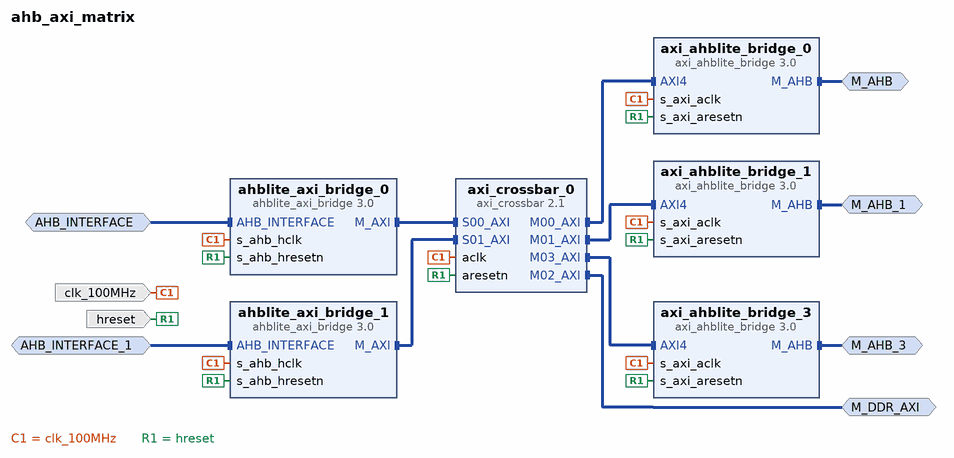
[diagram p0: block diagram of the top level]
# Vivado block design ahb_axi_matrix, xc7k325tffg900-2, Vivado 2019.1
create_bd_design ahb_axi_matrix

create_bd_intf_port -mode Slave -vlnv xilinx.com:interface:ahblite_rtl:2.0 AHB_INTERFACE
create_bd_intf_port -mode Slave -vlnv xilinx.com:interface:ahblite_rtl:2.0 AHB_INTERFACE_1
create_bd_intf_port -mode Master -vlnv xilinx.com:interface:ahblite_rtl:2.0 M_AHB
create_bd_intf_port -mode Master -vlnv xilinx.com:interface:ahblite_rtl:2.0 M_AHB_1
create_bd_intf_port -mode Master -vlnv xilinx.com:interface:ahblite_rtl:2.0 M_AHB_3
create_bd_intf_port -mode Master -vlnv xilinx.com:interface:aximm_rtl:1.0 M_DDR_AXI
set_property -dict [list \
  CONFIG.ADDR_WIDTH 32 \
  CONFIG.DATA_WIDTH 32 \
  CONFIG.HAS_BURST 0 \
  CONFIG.HAS_QOS 0 \
  CONFIG.HAS_REGION 0 \
  CONFIG.NUM_READ_OUTSTANDING 2 \
  CONFIG.NUM_WRITE_OUTSTANDING 2 \
  CONFIG.PROTOCOL AXI4 \
] [get_bd_intf_ports M_DDR_AXI]
create_bd_port -dir I -type clk clk_100MHz
set_property -dict {CONFIG.FREQ_HZ 100000000} [get_bd_ports clk_100MHz]
create_bd_port -dir I hreset

create_bd_cell -type ip -vlnv xilinx.com:ip:axi_crossbar:2.1 axi_crossbar_0
set_property -dict [list \
  CONFIG.ADDR_WIDTH 32 \
  CONFIG.M00_A00_ADDR_WIDTH 16 \
  CONFIG.M00_A00_BASE_ADDR 0x00000000FFFF0000 \
  CONFIG.M00_S00_READ_CONNECTIVITY 1 \
  CONFIG.M00_S00_WRITE_CONNECTIVITY 1 \
  CONFIG.M00_S01_READ_CONNECTIVITY 1 \
  CONFIG.M00_S01_WRITE_CONNECTIVITY 1 \
  CONFIG.M01_A00_ADDR_WIDTH 16 \
  CONFIG.M01_A00_BASE_ADDR 0x0000000010000000 \
  CONFIG.M01_S00_READ_CONNECTIVITY 1 \
  CONFIG.M01_S00_WRITE_CONNECTIVITY 1 \
  CONFIG.M01_S01_READ_CONNECTIVITY 1 \
  CONFIG.M01_S01_WRITE_CONNECTIVITY 1 \
  CONFIG.M02_A00_ADDR_WIDTH 22 \
  CONFIG.M02_A00_BASE_ADDR 0x0000000040000000 \
  CONFIG.M02_S00_READ_CONNECTIVITY 1 \
  CONFIG.M02_S00_WRITE_CONNECTIVITY 1 \
  CONFIG.M02_S01_READ_CONNECTIVITY 1 \
  CONFIG.M02_S01_WRITE_CONNECTIVITY 1 \
  CONFIG.M03_A00_ADDR_WIDTH 20 \
  CONFIG.M03_A00_BASE_ADDR 0x0000000080000000 \
  CONFIG.M03_S00_READ_CONNECTIVITY 1 \
  CONFIG.M03_S00_WRITE_CONNECTIVITY 1 \
  CONFIG.M03_S01_READ_CONNECTIVITY 1 \
  CONFIG.M03_S01_WRITE_CONNECTIVITY 1 \
  CONFIG.NUM_MI 4 \
  CONFIG.NUM_SI 2 \
] [get_bd_cells axi_crossbar_0]
create_bd_cell -type ip -vlnv xilinx.com:ip:ahblite_axi_bridge:3.0 ahblite_axi_bridge_0
create_bd_cell -type ip -vlnv xilinx.com:ip:ahblite_axi_bridge:3.0 ahblite_axi_bridge_1
create_bd_cell -type ip -vlnv xilinx.com:ip:axi_ahblite_bridge:3.0 axi_ahblite_bridge_0
create_bd_cell -type ip -vlnv xilinx.com:ip:axi_ahblite_bridge:3.0 axi_ahblite_bridge_1
create_bd_cell -type ip -vlnv xilinx.com:ip:axi_ahblite_bridge:3.0 axi_ahblite_bridge_3

# ---- connections ----

connect_bd_intf_net [get_bd_intf_ports M_DDR_AXI] [get_bd_intf_pins axi_crossbar_0/M02_AXI]
connect_bd_intf_net [get_bd_intf_pins axi_crossbar_0/M01_AXI] [get_bd_intf_pins axi_ahblite_bridge_1/AXI4]
connect_bd_intf_net [get_bd_intf_pins axi_crossbar_0/M00_AXI] [get_bd_intf_pins axi_ahblite_bridge_0/AXI4]
connect_bd_intf_net [get_bd_intf_pins ahblite_axi_bridge_0/M_AXI] [get_bd_intf_pins axi_crossbar_0/S00_AXI]
connect_bd_intf_net [get_bd_intf_pins ahblite_axi_bridge_1/M_AXI] [get_bd_intf_pins axi_crossbar_0/S01_AXI]
connect_bd_intf_net [get_bd_intf_ports AHB_INTERFACE] [get_bd_intf_pins ahblite_axi_bridge_0/AHB_INTERFACE]
connect_bd_intf_net [get_bd_intf_pins axi_crossbar_0/M03_AXI] [get_bd_intf_pins axi_ahblite_bridge_3/AXI4]
connect_bd_intf_net [get_bd_intf_ports M_AHB] [get_bd_intf_pins axi_ahblite_bridge_0/M_AHB]
connect_bd_intf_net [get_bd_intf_ports M_AHB_3] [get_bd_intf_pins axi_ahblite_bridge_3/M_AHB]
connect_bd_intf_net -intf_net AHB_INTERFACE_1_1 [get_bd_intf_ports AHB_INTERFACE_1] [get_bd_intf_pins ahblite_axi_bridge_1/AHB_INTERFACE]
connect_bd_intf_net [get_bd_intf_ports M_AHB_1] [get_bd_intf_pins axi_ahblite_bridge_1/M_AHB]
connect_bd_net [get_bd_ports clk_100MHz] \
  [get_bd_pins axi_crossbar_0/aclk] [get_bd_pins axi_ahblite_bridge_0/s_axi_aclk] \
  [get_bd_pins axi_ahblite_bridge_1/s_axi_aclk] [get_bd_pins axi_ahblite_bridge_3/s_axi_aclk] \
  [get_bd_pins ahblite_axi_bridge_0/s_ahb_hclk] [get_bd_pins ahblite_axi_bridge_1/s_ahb_hclk]
connect_bd_net -net rst_clk_100MHz_100M_peripheral_aresetn [get_bd_ports hreset] \
  [get_bd_pins axi_crossbar_0/aresetn] [get_bd_pins axi_ahblite_bridge_0/s_axi_aresetn] \
  [get_bd_pins axi_ahblite_bridge_1/s_axi_aresetn] [get_bd_pins axi_ahblite_bridge_3/s_axi_aresetn] \
  [get_bd_pins ahblite_axi_bridge_0/s_ahb_hresetn] [get_bd_pins ahblite_axi_bridge_1/s_ahb_hresetn]

# ---- address map ----
assign_bd_address -offset 0x10000000 -range 64K -target_address_space [get_bd_addr_spaces AHB_INTERFACE] [get_bd_addr_segs M_AHB_1/Reg]
assign_bd_address -offset 0x40000000 -range 256M -target_address_space [get_bd_addr_spaces AHB_INTERFACE] [get_bd_addr_segs M_DDR_AXI/Reg]
assign_bd_address -offset 0x80000000 -range 16M -target_address_space [get_bd_addr_spaces AHB_INTERFACE] [get_bd_addr_segs M_AHB_3/Reg]
assign_bd_address -offset 0xFFFF0000 -range 64K -target_address_space [get_bd_addr_spaces AHB_INTERFACE] [get_bd_addr_segs M_AHB/Reg]
assign_bd_address -offset 0x10000000 -range 64K -target_address_space [get_bd_addr_spaces AHB_INTERFACE_1] [get_bd_addr_segs M_AHB_1/Reg]
assign_bd_address -offset 0x40000000 -range 256M -target_address_space [get_bd_addr_spaces AHB_INTERFACE_1] [get_bd_addr_segs M_DDR_AXI/Reg]
assign_bd_address -offset 0x80000000 -range 16M -target_address_space [get_bd_addr_spaces AHB_INTERFACE_1] [get_bd_addr_segs M_AHB_3/Reg]
assign_bd_address -offset 0xFFFF0000 -range 64K -target_address_space [get_bd_addr_spaces AHB_INTERFACE_1] [get_bd_addr_segs M_AHB/Reg]

validate_bd_design
save_bd_design
